# EAGLE design IMU_BRB_v2 (EAGLE 8.3.2)

## Sheet 1 of 2
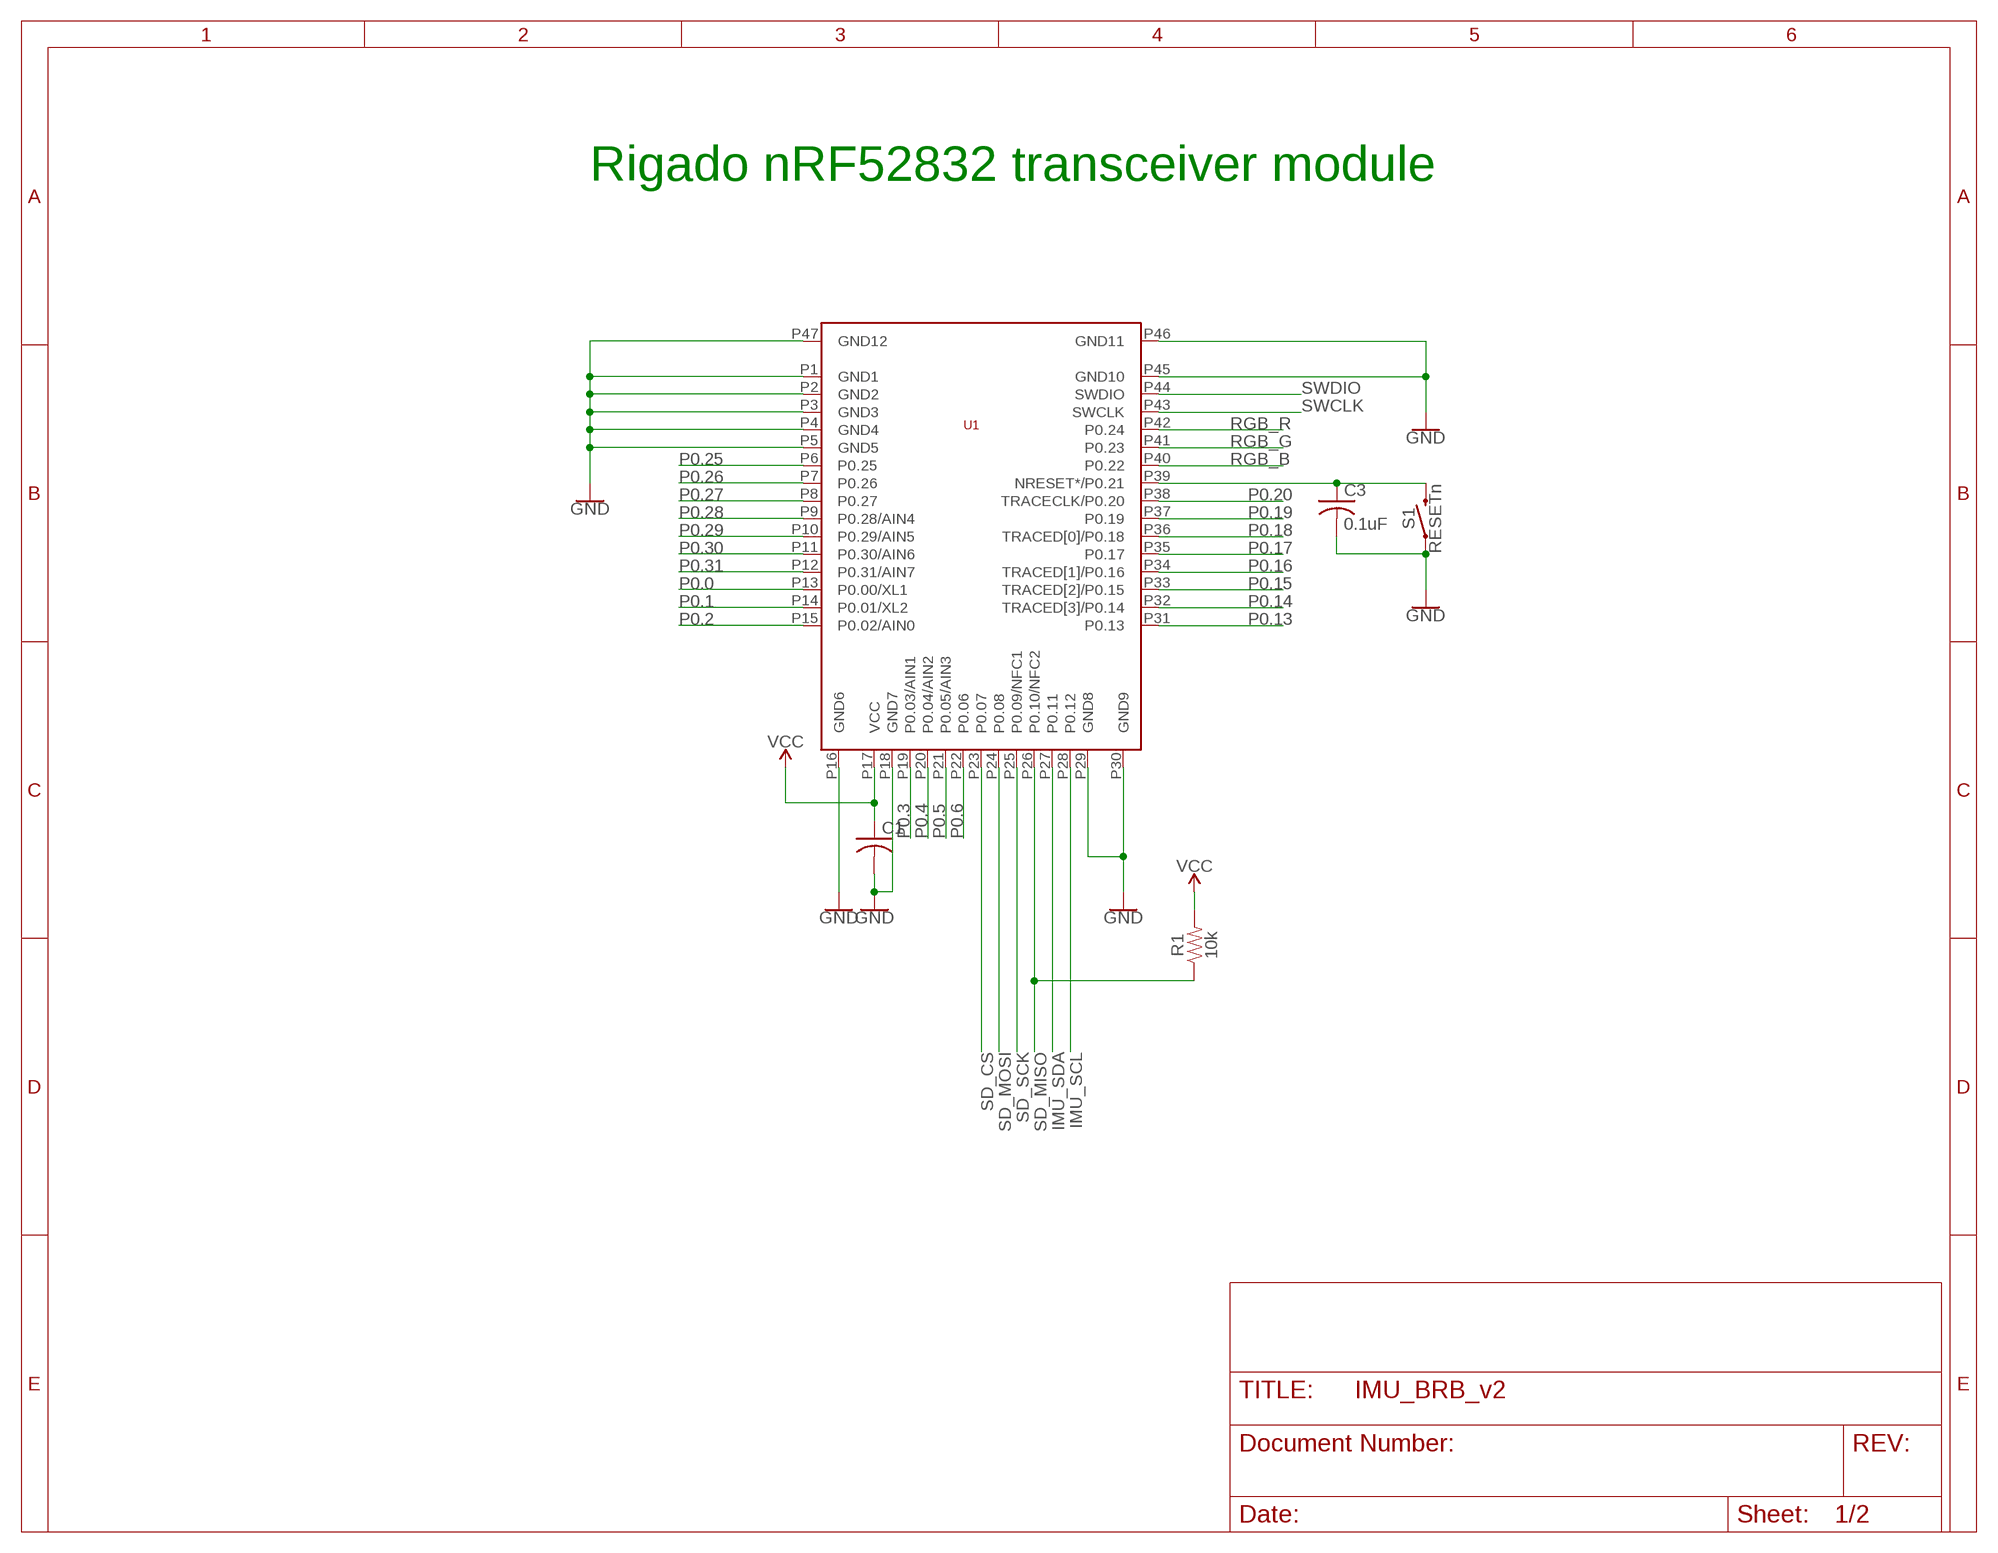
[diagram p0: schematic, sheet 1]

### Parts
C1  C-USC0603  [C0603]
C3  0.1uF  C-USC0603  [C0603]
R1  10k  10KOHM-0603-1/10W-1%  [0603]
S1  RESETn  MOMENTARY-SWITCH-SPST-SMD-4.6X2.8MM  [TACTILE_SWITCH_SMD_4.6X2.8MM]
U1  BMD-300  [BMD-300]

### Nets
3V3: C1.1 R1.2 U1.P17(VCC) ; supply symbol labelled VCC ; also sheet 2
GND: C1.2 C3.2 S1.1 S1.2 U1.P1(GND1) U1.P2(GND2) U1.P3(GND3) U1.P4(GND4) U1.P5(GND5) U1.P16(GND6) U1.P18(GND7) U1.P29(GND8) U1.P30(GND9) U1.P45(GND10) U1.P46(GND11) U1.P47(GND12) ; also sheet 2
IMU_SCL: U1.P28(P0.12) ; also sheet 2
IMU_SDA: U1.P27(P0.11) ; also sheet 2
N$2: C3.1 S1.3 S1.4 U1.P39(NRESET*/P0.21)
P0.0: U1.P13(P0.00/XL1)
P0.1: U1.P14(P0.01/XL2)
P0.2: U1.P15(P0.02/AIN0)
P0.3: U1.P19(P0.03/AIN1) ; also sheet 2
P0.4: U1.P20(P0.04/AIN2) ; also sheet 2
P0.5: U1.P21(P0.05/AIN3) ; also sheet 2
P0.6: U1.P22(P0.06) ; also sheet 2
P0.13: U1.P31(P0.13)
P0.14: U1.P32(TRACED[3]/P0.14)
P0.15: U1.P33(TRACED[2]/P0.15)
P0.16: U1.P34(TRACED[1]/P0.16)
P0.17: U1.P35(P0.17)
P0.18: U1.P36(TRACED[0]/P0.18)
P0.19: U1.P37(P0.19)
P0.20: U1.P38(TRACECLK/P0.20)
P0.25: U1.P6(P0.25)
P0.26: U1.P7(P0.26)
P0.27: U1.P8(P0.27)
P0.28: U1.P9(P0.28/AIN4)
P0.29: U1.P10(P0.29/AIN5)
P0.30: U1.P11(P0.30/AIN6)
P0.31: U1.P12(P0.31/AIN7)
RGB_B: U1.P40(P0.22) ; also sheet 2
RGB_G: U1.P41(P0.23) ; also sheet 2
RGB_R: U1.P42(P0.24) ; also sheet 2
SD_CS: U1.P23(P0.07) ; also sheet 2
SD_MISO: R1.1 U1.P26(P0.10/NFC2) ; also sheet 2
SD_MOSI: U1.P24(P0.08) ; also sheet 2
SD_SCK: U1.P25(P0.09/NFC1) ; also sheet 2
SWCLK: U1.P43(SWCLK) ; also sheet 2
SWDIO: U1.P44(SWDIO) ; also sheet 2

### Notes on the sheet
- Rigado nRF52832 transceiver module

## Sheet 2 of 2
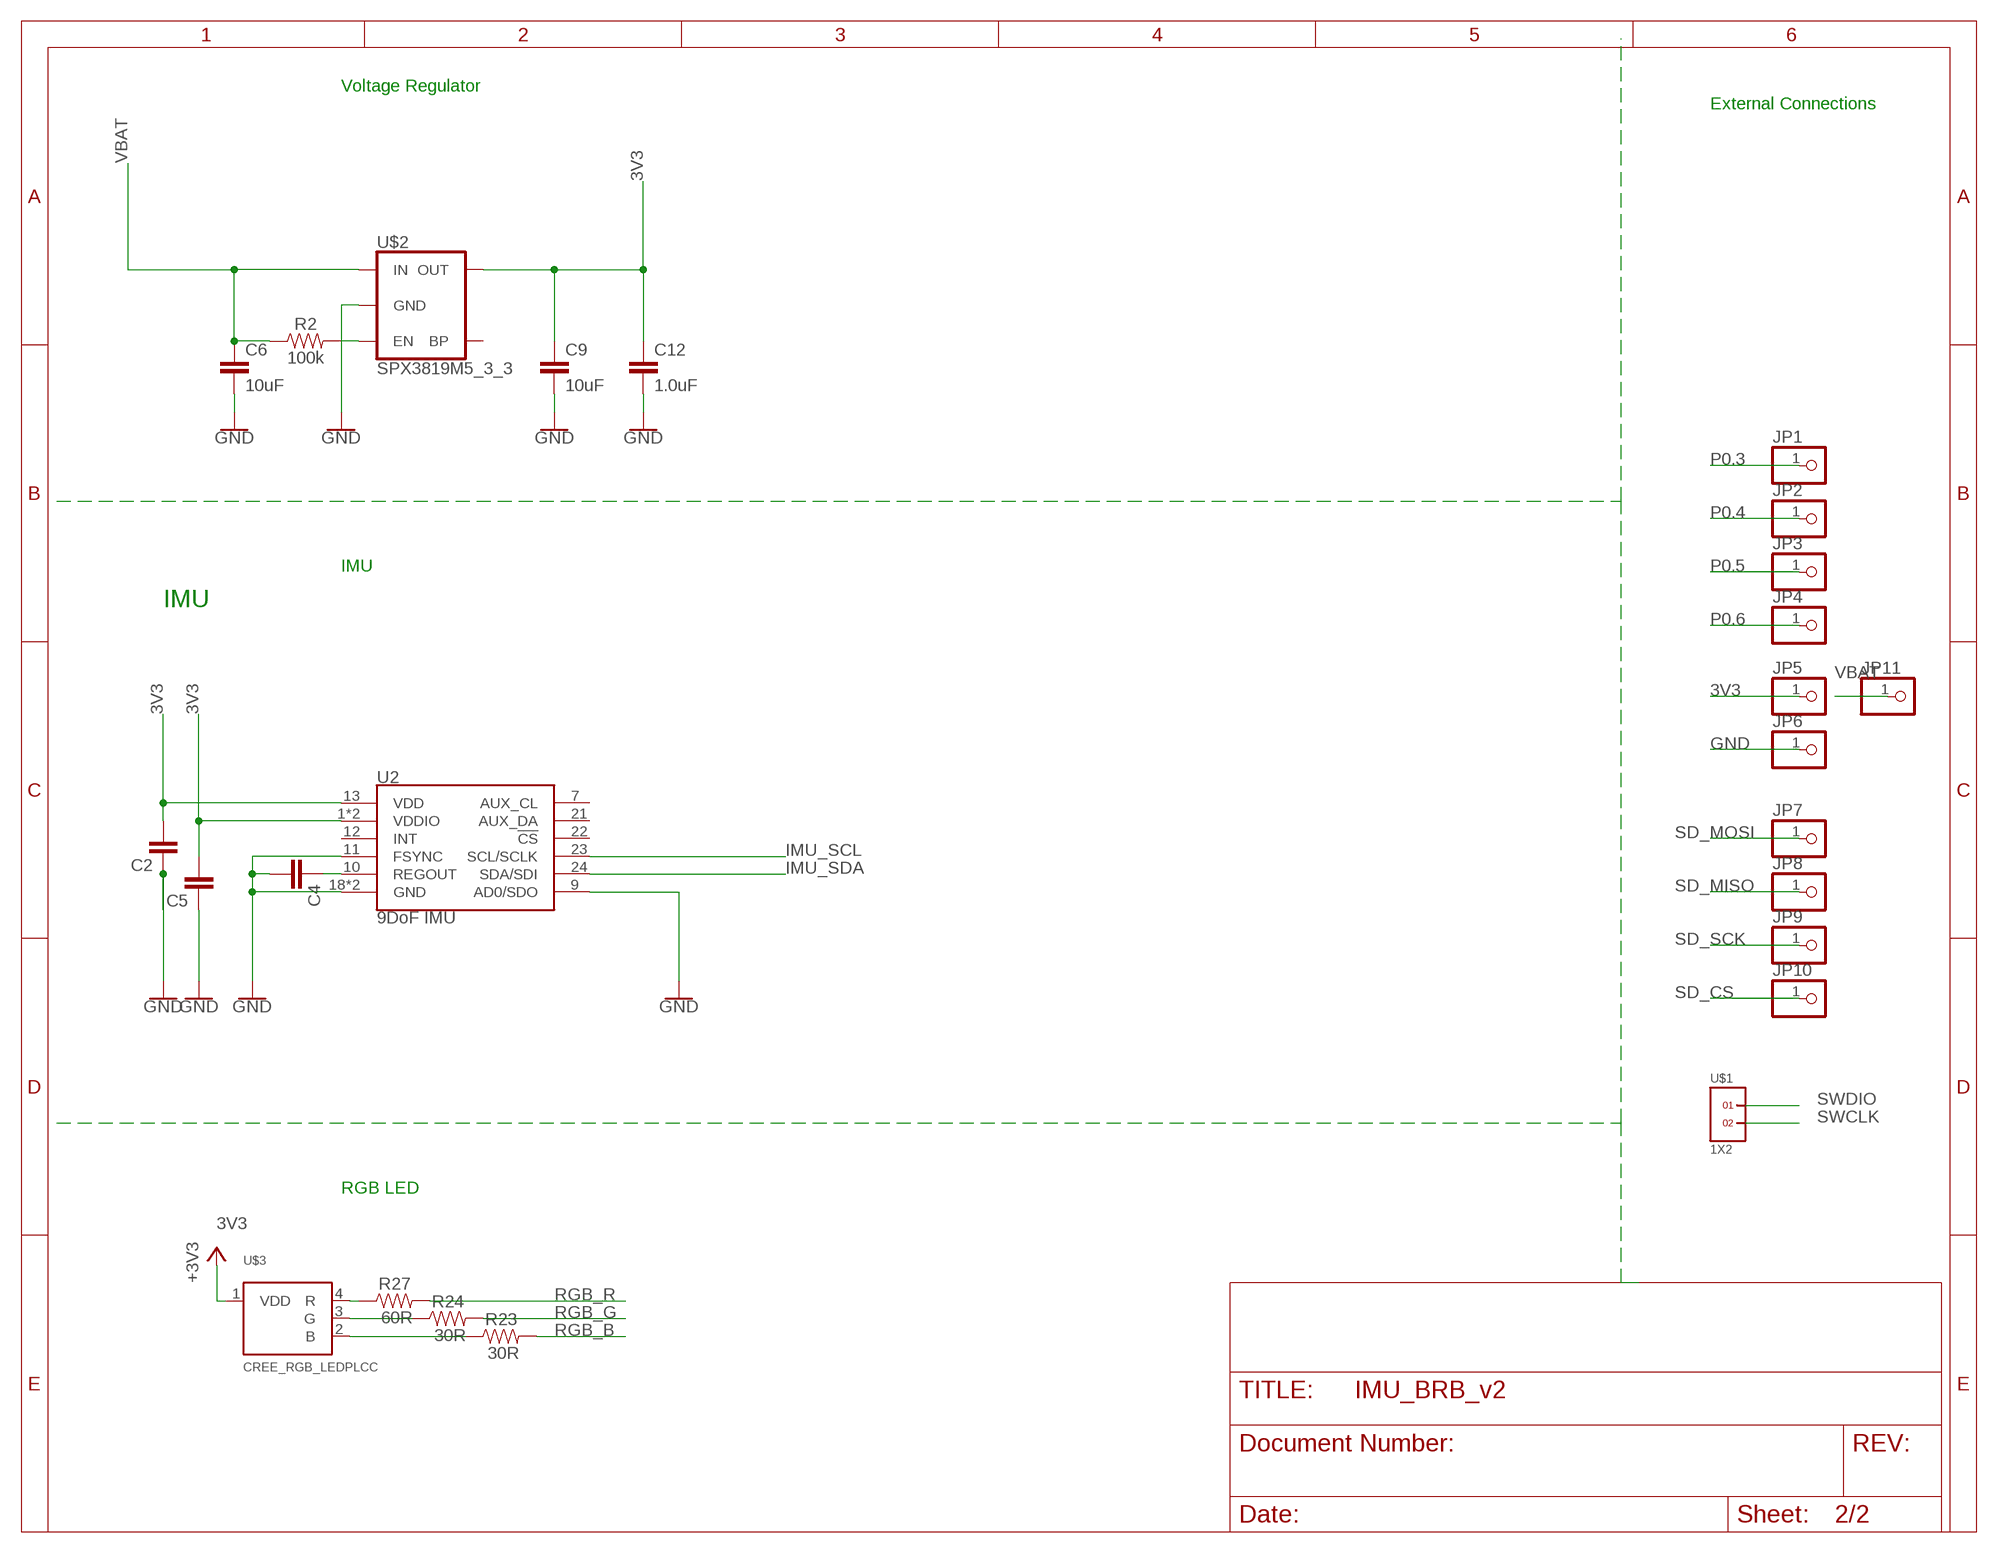
[diagram p1: schematic, sheet 2]

### Parts
C2  0.1UF-0603-25V-(+80/-20%)  [0603]
C4  0.1UF-0603-25V-(+80/-20%)  [0603]
C5  0.1UF-0603-25V-(+80/-20%)  [0603]
C6  10uF  10UF-0805-10V-10%  [0805]
C9  10uF  10UF-0805-10V-10%  [0805]
C12  1.0uF  1.0UF-0603-16V-10%  [0603]
JP1  PINHD-1X1  [1X01]
JP2  PINHD-1X1  [1X01]
JP3  PINHD-1X1  [1X01]
JP4  PINHD-1X1  [1X01]
JP5  PINHD-1X1  [1X01]
JP6  PINHD-1X1  [1X01]
JP7  PINHD-1X1  [1X01]
JP8  PINHD-1X1  [1X01]
JP9  PINHD-1X1  [1X01]
JP10  PINHD-1X1  [1X01]
JP11  PINHD-1X1  [1X01]
R2  100k  100KOHM-0603-1/10W-1%  [0603]
R23  30R  RESISTOR0603  [0603]
R24  30R  RESISTOR0603  [0603]
R27  60R  RESISTOR0603  [0603]
U2  9DoF IMU  MPU-9250  [QFN24-3X3]
U$1  1X2  [1X2]
U$2  SPX3819M5_3_3  V_REG_SPX3819-SOT23-5  [SOT23-5]
U$3  CREE_RGB_LEDPLCC  [CREE_RGB]

### Nets
3V3: C2.2 C5.2 C9.1 C12.1 JP5.1 U2.1(VDDIO) U2.8(VDDIO) U2.13(VDD) U$2.5(OUT) U$3.1(VDD) ; supply symbol labelled +3V3 ; also sheet 1
EN: R2.2 U$2.3(EN)
GND: C2.1 C4.2 C5.1 C6.2 C9.2 C12.2 JP6.1 U2.11(FSYNC) U2.18(GND) U2.20(GND) U$2.2(GND) ; also sheet 1
IMU_SCL: U2.23(SCL/SCLK) ; also sheet 1
IMU_SDA: U2.24(SDA/SDI) ; also sheet 1
N$5: U2.9(AD0/SDO) ; supply symbol labelled GND
N$7: C4.1 U2.10(REGOUT)
N$12: R27.1 U$3.4(R)
N$13: R24.1 U$3.3(G)
N$14: R23.1 U$3.2(B)
P0.3: JP1.1 ; also sheet 1
P0.4: JP2.1 ; also sheet 1
P0.5: JP3.1 ; also sheet 1
P0.6: JP4.1 ; also sheet 1
RGB_B: R23.2 ; also sheet 1
RGB_G: R24.2 ; also sheet 1
RGB_R: R27.2 ; also sheet 1
SD_CS: JP10.1 ; also sheet 1
SD_MISO: JP8.1 ; also sheet 1
SD_MOSI: JP7.1 ; also sheet 1
SD_SCK: JP9.1 ; also sheet 1
SWCLK: U$1.2 ; also sheet 1
SWDIO: U$1.1 ; also sheet 1
VBAT: C6.1 JP11.1 R2.1 U$2.1(IN)
Unconnected: U2.7(AUX_CL) U2.12(INT) U2.21(AUX_DA) U2.22(!CS) U$2.4(BP)

### Notes on the sheet
- Voltage Regulator
- External Connections
- IMU
- IMU
- RGB LED

## Library data of the parts
C1 C3 = resistor:C-US: CAPACITOR, American symbol
C2 C4 C5 = SparkFun-Capacitors:0.1UF: 0.1µF ceramic capacitors A capacitor is a passive two-terminal electrical component used to store electrical energy temporarily in an electric field.; PROD_ID: CAP-00810; VALUE: 0.1uF
C6 C9 = SparkFun-Capacitors:10UF: 10.0µF ceramic capacitors A capacitor is a passive two-terminal electrical component used to store electrical energy temporarily in an electric field.; PROD_ID: CAP-11330
C12 = SparkFun-Capacitors:1.0UF: 1µF ceramic capacitors A capacitor is a passive two-terminal electrical component used to store electrical energy temporarily in an electric field.; PROD_ID: CAP-00868
JP1-JP11 = pinhead:PINHD-1X1: PIN HEADER
R1 = SparkFun-Resistors:10KOHM: 10kΩ resistor A resistor is a passive two-terminal electrical component that implements electrical resistance as a circuit element. Resistors act to reduce current flow, and, at the same time, act to lower voltage levels within circuits. - Wikipedia; PROD_ID: RES-00824
R2 = SparkFun-Resistors:100KOHM: 100kΩ resistor A resistor is a passive two-terminal electrical component that implements electrical resistance as a circuit element. Resistors act to reduce current flow, and, at the same time, act to lower voltage levels within circuits. - Wikipedia; PROD_ID: RES-07828
R23 R24 R27 = SparkFun-Resistors:RESISTOR: Generic Resistor Package
S1 = SparkFun-Switches:MOMENTARY-SWITCH-SPST: Momentary Switch (Pushbutton) - SPST Normally-open (NO) SPST momentary switches (buttons, pushbuttons). Variants PTH-12MM - 12mm square, through-hole Momentary Pushbutton Switch - 12mm Square <https://www.sparkfun.com/products/9190> (COM-09190) PTH-6.0MM, PTH-6.0MM-KIT - 6.0mm square, through-hole Mini Pushbutton Switch <https://www.sparkfun.com/products/97> (COM-00097) KIT package intended for soldering kit's - only one side of pads' copper is exposed. PTH-RIGHT-ANGLE-KIT - Right-angle, through-hole Right Angle Tactile Button <https://www.sparkfun.com/products/10791> - Used on SparkFun BigTime Watch Kit <https://www.sparkfun.com/products/11734> SMD-12MM - 12mm square, surface-mount Tactile Button - SMD (12mm) <https://www.sparkfun.com/products/12993> (COM-12993) Used on SparkFun PicoBoard <https://www.sparkfun.com/products/11888> SMD-4.5MM - 4.5mm Square Trackball Switch Used on SparkFun Blackberry Trackballer Breakout <https://www.sparkfun.com/products/13169> SMD-4.6MMX2.8MM - 4.60mm x 2.80mm, surface mount Used on SparkFun SAMD21 Mini Breakout <https://www.sparkfun.com/products/13664> SMD-5.2MM, SMD-5.2-REDUNDANT - 5.2mm square, surface-mount Mini Pushbutton Switch - SMD <https://www.sparkfun.com/products/8720> (COM-08720) Used on Arduino Pro Mini <https://www.sparkfun.com/products/11114> REDUNDANT package connects both switch circuits together SMD-6.0X3.5MM - 6.0 x 3.5mm, surface mount Momentary Reset Switch SMD <https://www.sparkfun.com/products/8229> (COM-08229) SMD-6.2MM-TALL - 6.2mm square, surface mount Tactile Button - SMD (6mm) <https://www.sparkfun.com/products/12992> Used on SparkFun Digital Sandbox <https://www.sparkfun.com/products/12651> SMD-RIGHT-ANGLE - Right-angle, surface mount Used on SparkFun Block for Intel® Edison - Arduino <https://www.sparkfun.com/products/13036>; PROD_ID: SWCH-13065
U1 = BMD-300:BMD-300
U2 = SparkFun-Sensors:MPU-9250: MPU-9250 9 Degree of Freedom IMU System in Package that contains MPU-6500 & AK8963 NC pin 19. 2-6 & 14-17 not internally connected. May be used for PCB trace routing. Datasheet <https://cdn.sparkfun.com/assets/learn_tutorials/5/5/0/MPU9250REV1.0.pdf> SparkFun Products: SparkFun 9DoF Razor IMU M0 <https://www.sparkfun.com/products/14001> SparkFun IMU Breakout - MPU-9250 <https://www.sparkfun.com/products/13762>; PROD_ID: IC-13192
U$1 = headers.edge(.1in):1X2
U$2 = SparkFun-IC-Power:V_REG_SPX3819: SPX3819 Voltage Regulator 3.3V 500mA, 16V input Datasheet <https://www.exar.com/content/document.ashx?id=22106> SparkFun Products: SparkFun Serial Controlled Motor Driver <https://www.sparkfun.com/products/13911>; PROD_ID: VREG-13321
U$3 = jacob_lib:CREE_RGB_LED: CREE CLMVB-FKA-CFHEHLCBB7A363 common anode 4 pin SMD RGB LED

## Board
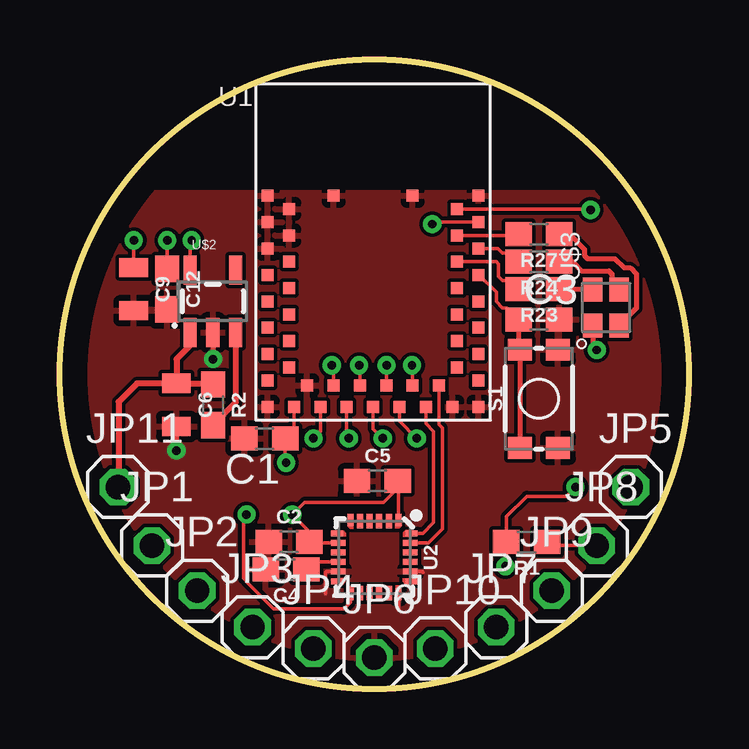
[diagram p2: board, top side]
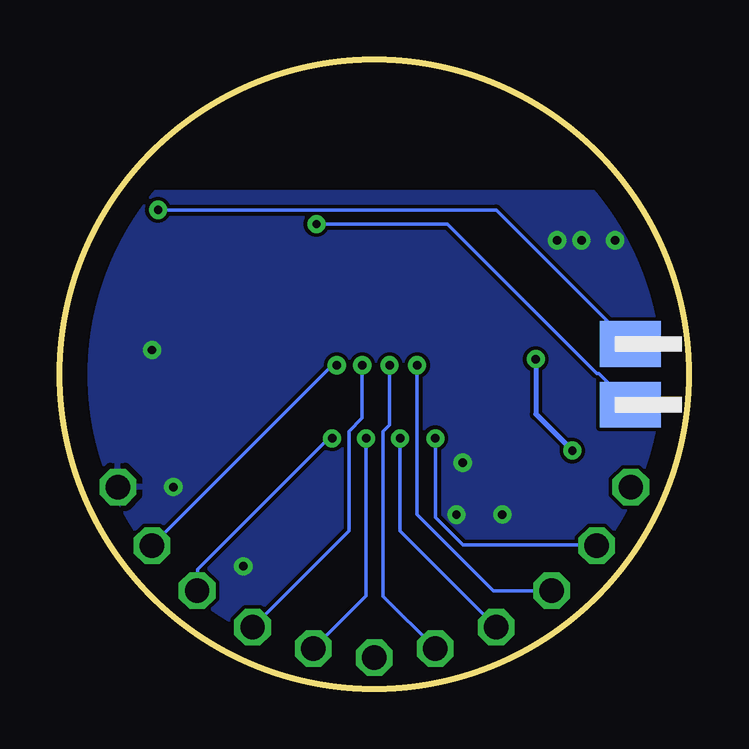
[diagram p3: board, bottom side, seen from below]

Size 26.22 x 26.22 mm. Coordinates in mm from the lower left corner, seen from the top.
Outline: circle at 13.11,13.11 radius 13.11
Copper layers (1*16): Top 0.035mm / dielectric 1.5mm / Bottom 0.035mm
Design rules "default": minimum track width 6mil, minimum drill 0.35mm, track to track 6mil, track to pad 6mil, pad to pad 6mil, via to via 6mil, smd to smd 6mil, copper to edge 40mil, drill to drill 6mil, minimum pad ring 10mil, minimum via ring 8mil, stop-mask expansion 4mil, vias tented up to drill 0mil, thermal gap 10mil

### Footprints (pad centres in the part's own frame; a part is rotated, then mirrored left to right if it is on the bottom)
C0603 = smd 1.1 x 1: 1 -0.85,0; 2 0.85,0
0603 = smd 1.1 x 1: 1 -0.85,0; 2 0.85,0
0805 = smd 0.8 x 1.2: 1 -0.9,0; 2 0.9,0
1X01 = drill 1.016 octagon: 1 0,0
TACTILE_SWITCH_SMD_4.6X2.8MM = smd 0.9 x 1: 1 -2.05,-0.8; 2 2.05,-0.8; 3 2.05,0.8; 4 -2.05,0.8
BMD-300 = smd 0.5 x 0.5: P1 0.5,9.35; P2 1.4,8.8; P3 0.5,8.25; P4 1.4,7.7; P5 0.5,7.15; P6 1.4,6.6; P7 0.5,6.05; P8 1.4,5.5; P9 0.5,4.95; P10 1.4,4.4; P11 0.5,3.85; P12 1.4,3.3; P13 0.5,2.75; P14 1.4,2.2; P15 0.5,1.65; P16 0.5,0.55; P17 1.6,0.55; P18 2.15,1.45; P19 2.7,0.55; P20 3.25,1.45; P21 3.8,0.55; P22 4.35,1.45; P23 4.9,0.55; P24 5.45,1.45; P25 6,0.55; P26 6.55,1.45; P27 7.1,0.55; P28 7.65,1.45; P29 8.2,0.55; P30 9.3,0.55; P31 9.3,1.65; P32 8.4,2.2; P33 9.3,2.75; P34 8.4,3.3; P35 9.3,3.85; P36 8.4,4.4; P37 9.3,4.95; P38 8.4,5.5; P39 9.3,6.05; P40 8.4,6.6; P41 9.3,7.15; P42 8.4,7.7; P43 9.3,8.25; P44 8.4,8.8; P45 9.3,9.35; P46 6.55,9.35; P47 3.25,9.35
QFN24-3X3 = smd 0.495 x 0.25: 1 -1.552,1; 6 -1.552,-1; 13 1.552,-1; 18 1.552,1 | smd 0.6 x 0.25: 2 -1.5,0.6; 3 -1.5,0.2; 4 -1.5,-0.2; 5 -1.5,-0.6; 14 1.5,-0.6; 15 1.5,-0.2; 16 1.5,0.2; 17 1.5,0.6 | smd 0.25 x 0.495: 7 -1,-1.552; 12 1,-1.552; 19 1,1.552; 24 -1,1.552 | smd 0.25 x 0.6: 8 -0.6,-1.5; 9 -0.2,-1.5; 10 0.2,-1.5; 11 0.6,-1.5; 20 0.6,1.5; 21 0.2,1.5; 22 -0.2,1.5; 23 -0.6,1.5
1X2 = smd 1.905 x 2.54: 1 0,-2.159; 2 2.54,-2.159
SOT23-5 = smd 0.55 x 1.2: 1 -0.95,-1.3; 2 0,-1.3; 3 0.95,-1.3; 4 0.95,1.3; 5 -0.95,1.3
CREE_RGB = smd 1 x 0.8: 1 0.75,-0.55; 2 -0.75,-0.55; 3 -0.75,0.55; 4 0.75,0.55

### Placement (x,y rotation side)
C1  8.54,10.44 180 top
C2  9.55,6.12 0 top
C3  19.97,15.4 0 top
C4  9.43,4.98 180 top
C5  13.24,8.66 0 top
C6  4.85,11.84 270 top
C9  3.08,16.67 270 top
C12  4.47,16.67 270 top
JP1  3.84,5.97 0 top
JP2  5.72,4.09 0 top
JP3  8.03,2.57 0 top
JP4  10.57,1.68 0 top
JP5  23.8,8.41 0 top
JP6  13.11,1.3 0 top
JP7  18.19,2.57 0 top
JP8  22.38,5.97 0 top
JP9  20.5,4.09 0 top
JP10  15.65,1.68 0 top
JP11  2.42,8.41 0 top
R1  19.46,6.12 180 top
R2  6.38,11.84 270 top
R23  19.97,16.67 180 top
R24  19.97,17.81 180 top
R27  19.97,18.95 180 top
S1  19.97,12.09 90 top
U1  8.16,11.2 0 top
U2  13.11,5.49 270 top
U$1  0.28,14.38 270 bottom
U$2  6.38,16.16 0 top
U$3  22.76,15.9 270 top

### Tracks (layer width: path | path; a pad name or v marks a point on that pad's centre or on a via)
3V3  (via drill 0.35)
  Top 0.152: v18.57,5.11 18.61,5.15 R1.2 18.61,7.18 19.46,8.03 21.11,8.03 v21.49,8.41 | U1.P17 9.76,10.81 C1.1 9.39,9.47 v9.43,9.43 | U$2.5 5.43,18.64 v5.49,18.7 | C12.1 v4.47,18.7 | C9.1 v3.08,18.7 | U2.8 10.44,6.09 C2.2 10.4,6.54 v9.69,7.26 10.2,7.78 13.49,7.78 14.09,8.37 C5.2 14.11,8.64 U2.1 | U2.13 12.11,3.6 11.84,3.33 8.91,3.33 7.87,4.37 7.65,4.6 7.65,7.14 v7.78,7.27
  Top 0.2: U$3.1 22.21,14.29 v22.38,14.13
  pour Bottom: -4.67,30.89 30.89,30.89 30.89,-4.67 -4.67,-4.67
EN
  Top 0.254: U$2.3 7.33,11.94 R2.2
GND  (via drill 0.35)
  Top 0.152: U2.18 14.11,3.35 14.13,3.33 | U2.20 15.11,4.89 15.14,4.85 | U2.11 11.11,4.89 11.08,4.85 11.08,3.97
  Top 0.2: U$2.2 v6.38,13.74 | v4.85,9.93 C6.2
  Bottom 0.2: v6.38,13.74 6.38,11.46 v4.85,9.93
  pour Top: -4.67,30.89 30.89,30.89 30.89,-4.67 -4.67,-4.67
IMU_SCL
  Top 0.152: U1.P28 15.81,11.01 15.94,10.88 15.94,6.67 15.36,6.09 U2.23
IMU_SDA
  Top 0.152: U1.P27 15.26,11.06 15.58,10.74 15.58,6.95 15.13,6.49 U2.24
N$2
  Top 0.152: U1.P39 17.47,17.25 18.19,16.54 18.19,16.15 18.45,15.89 18.63,15.89 C3.1
  Top 0.2: C3.1 19.12,14.19 S1.3 S1.4
N$7
  Top 0.152: U2.10 10.71,5.29 C4.1
N$12
  Top 0.2: R27.1 21.24,18.95 21.87,18.32 21.87,18.06 22,17.94 23.14,17.94 23.52,17.55 23.78,17.55 24.03,17.3 24.03,15.87 U$3.4
N$13
  Top 0.2: R24.1 21.36,17.81 21.75,17.43 22.89,17.43 23.02,17.3 23.02,16.95 U$3.3
N$14
  Top 0.2: R23.1 22.2,16.67 U$3.2
P0.3  (via drill 0.35)
  Top 0.152: U1.P19 10.86,10.73 v10.57,10.44
  Bottom 0.152: v10.57,10.44 10.57,7.14 9.43,6 3.86,6 JP1.1
P0.4  (via drill 0.35)
  Top 0.152: U1.P20 11.41,13.42 v11.33,13.49
  Bottom 0.152: v11.33,13.49 11.33,7.27 8.16,4.09 JP2.1
P0.5  (via drill 0.35)
  Top 0.152: U1.P21 11.96,10.53 v12.04,10.44
  Bottom 0.152: v12.04,10.44 12.04,6.58 JP3.1
P0.6  (via drill 0.35)
  Top 0.152: U1.P22 12.51,13.46 v12.47,13.49
  Bottom 0.152: v12.47,13.49 12.47,11.01 12.75,10.74 12.75,3.86 JP4.1
RGB_B
  Top 0.152: U1.P40 18.19,17.8 18.29,17.71 18.29,17.19 18.45,17.03 18.75,17.03 R23.2
RGB_G
  Top 0.152: R24.2 18.75,18.17 18.45,18.17 18.27,18.35 U1.P41
RGB_R
  Top 0.152: U1.P42 19.07,18.9 R27.2
SD_CS  (via drill 0.35)
  Top 0.152: U1.P23 13.06,10.84 v13.46,10.44
  Bottom 0.152: v13.46,10.44 13.46,3.87 JP10.1
SD_MISO  (via drill 0.35)
  Top 0.152: JP8.1 20.46,5.97 R1.1 | U1.P26 14.71,13.46 v14.68,13.49
  Bottom 0.152: v14.68,13.49 14.86,13.49 JP8.1
SD_MOSI  (via drill 0.35)
  Top 0.152: U1.P24 13.61,13.48 v13.62,13.49
  Bottom 0.152: v13.62,13.49 13.62,11.28 14.17,10.74 14.17,6.59 JP7.1
SD_SCK  (via drill 0.35)
  Top 0.152: U1.P25 14.16,11.16 v14.87,10.44
  Bottom 0.152: v14.87,10.44 15.01,10.44 20.48,4.98 20.48,4.12 JP9.1
SWCLK  (via drill 0.35)
  Top 0.152: U1.P43 15.6,19.45 v15.52,19.38
  Bottom 0.152: U$1.2 3.75,13.15 3.83,13.15 10.05,19.38 v15.52,19.38
SWDIO  (via drill 0.35)
  Top 0.152: U1.P44 22.09,20 v22.13,19.97
  Bottom 0.152: v22.13,19.97 8.03,19.97 U$1.1
VBAT
  Top 0.254: U$2.1 5.43,14.32 4.85,13.74 C6.1 | C6.1 6.33,12.74 R2.1 | C6.1 3.21,12.74 2.44,11.97 2.44,8.44 JP11.1